# Altium schematic sheet digital-isolator-3in-1out-power.SchDoc
size A3; DocumentNumber: 5; SheetNumber: 5; SheetTotal: 45; SheetDescription: Digital Isolator 3x in / 1x out with power
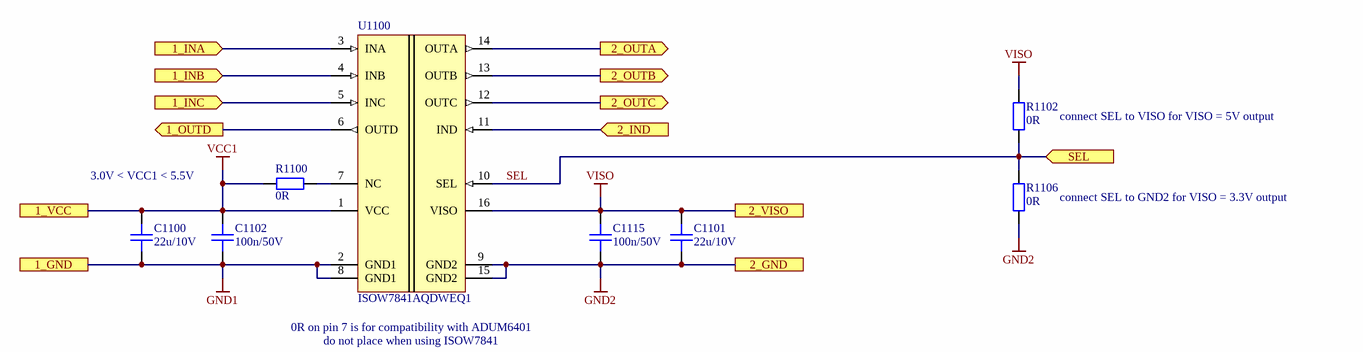
[diagram p0: digital-isolator-3in-1out-power.SchDoc]

## Parts
C1100  22u/10V  [CAPC3216X18N]
C1101  22u/10V  [CAPC3216X18N]
C1102  100n/50V  [CAPC1005X06N]
C1115  100n/50V  [CAPC1005X06N]
R1100  0R  [RESC1005X04N]
R1102  0R  [RESC1005X04N]
R1106  0R  [RESC1005X04N]
U1100  ISOW7841AQDWEQ1  [TI_DWE0016A]

## Ports
1_GND, 1_INA (in), 1_INB (in), 1_INC (in), 1_OUTD (out), 1_VCC, 2_GND, 2_IND (in), 2_OUTA (out), 2_OUTB (out), 2_OUTC (out), 2_VISO, SEL (in)

## Nets
GND1: C1100.1 C1102.1 U1100.2(GND1) U1100.8(GND1) ; port 1_GND
GND2: C1101.1 C1115.1 R1106.1 U1100.9(GND2) U1100.15(GND2) ; port 2_GND
VCC1: C1100.2 C1102.2 R1100.2 U1100.1(VCC) ; port 1_VCC
VISO: C1101.2 C1115.2 R1102.2 U1100.16(VISO) ; port 2_VISO
1_INA: U1100.3(INA) ; port 1_INA
1_INB: U1100.4(INB) ; port 1_INB
1_INC: U1100.5(INC) ; port 1_INC
1_OUTD: U1100.6(OUTD) ; port 1_OUTD
2_IND: U1100.11(IND) ; port 2_IND
2_OUTA: U1100.14(OUTA) ; port 2_OUTA
2_OUTB: U1100.13(OUTB) ; port 2_OUTB
2_OUTC: U1100.12(OUTC) ; port 2_OUTC
SEL: R1102.1 R1106.2 U1100.10(SEL) ; port SEL
NetR1100_1: R1100.1 U1100.7(NC)

## Notes on the sheet
- (near R1102) connect SEL to VISO for VISO = 5V output
- 3.0V < VCC1 < 5.5V
- (near R1106) connect SEL to GND2 for VISO = 3.3V output
- (near U1100) 0R on pin 7 is for compatibility with ADUM6401
- do not place when using ISOW7841
- Fraunhofer IISB
- Schottkystr. 10
- developed by:
- 91058 Erlangen
- Germany
- Author
- Project
- License
- Description
- File
- Version
- Release Date
- Sheet
- foxbms.org <https://foxbms.org>
- www.iisb.fraunhofer.de <https://www.iisb.fraunhofer.de/>
- foxBMS Team
- /

## Library data of the parts
C1100 C1101 = gen_C_ceramic_22u_10V_X7R_1206: MLCC; Capacitance: 22u; Rated Voltage: 10V; Dielectric: X7R; Case EIA: 1206; Case Metric: 3216; Automotive Qualified: True; Part Number: gen_C_ceramic_22u_10V_X7R_1206; Supplier 1: Digikey; Supplier Part Number 1: 587-4243-1-ND
C1102 C1115 = gen_C_ceramic_100n_50V_X7R_0402: MLCC; Capacitance: 100n; Rated Voltage: 50V; Dielectric: X7R; Case EIA: 0402; Case Metric: 1005; PnP Package: 0402C; PnP Value: 100nF/50V/X7R; PnP equipped: x; Automotive Qualified: True; AEC-Q Norm: AEC-Q200; Part Number: gen_C_ceramic_100n_50V_X7R_0402; Supplier 1: Farnell; Supplier Part Number 1: 2210822; ECCN: EAR99
R1100 = gen_R_0R_0402: SMD Resistor 0R 0402; Power: 0.063W; Case EIA: 0402; Case Metric: 1005; Maximum Working Voltage: 50V; PnP Package: 0402R; Automotive Qualified: True; PnP equipped: x; AEC-Q Norm: AEC-Q200; Part Number: gen_R_0R_0402; Operating Temperature: -55°C - +155°C; Resistance: 0R; Series: Jumper; PnP Value: 0R; Supplier 1: Farnell; Supplier Part Number 1: 1469661; Supplier 2: Farnell; Supplier Part Number 2: 2059190; ECCN: EAR99
R1102 R1106 = gen_R_0R_0402: SMD Resistor 0R 0402; Power: 0.063W; Case EIA: 0402; Case Metric: 1005; Maximum Working Voltage: 50V; PnP Package: 0402R; Automotive Qualified: True; AEC-Q Norm: AEC-Q200; PnP equipped: x; Part Number: gen_R_0R_0402; Operating Temperature: -55°C - +155°C; Resistance: 0R; Series: Jumper; PnP Value: 0R; Supplier 1: Farnell; Supplier Part Number 1: 1469661; Supplier 2: Farnell; Supplier Part Number 2: 2059190; ECCN: EAR99
U1100 = ISOW7841AQDWEQ1: Automotive High-Performance, 5000-VRMS Reinforced Quad-Channel Digital Isolator With Integrated High-Efficiency, Low-Emissions DC-DC Converter; Manufacturer: Texas Instruments; PnP Package: SOIC-16; Automotive Qualified: True; AEC-Q Norm: AEC-Q100; AEC-Q Grade: Grade 1; Part Number: ISOW7841AQDWEQ1; Part Name: ISOW7841AQDWEQ1; Operating Temperature: −40°C - +125°C; ComponentLink1Description: Datasheet; ComponentLink1URL: https://www.ti.com/lit/ds/symlink/isow7841a-q1.pdf?ts=1619516874236; Supplier 1: Digikey; Supplier Part Number 1: 296-ISOW7841AQDWEQ1-ND; Supplier 2: Mouser; Supplier Part Number 2: 595-ISOW7841AQDWEQ1; ECCN: EAR99